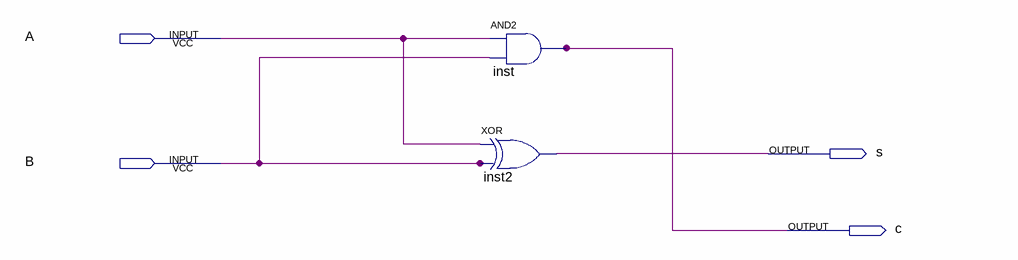
[diagram p0: schematic sheet]
// Quartus schematic half_adder.bdf as structural Verilog: 2 symbols, 4 pins
module half_adder (
  input  A,
  input  B,
  output s,
  output c
);

  and inst (c, A, B);
  xor inst2 (s, A, B);
endmodule
